# EAGLE design current_monitor_v1-2 (EAGLE 6.5.0)
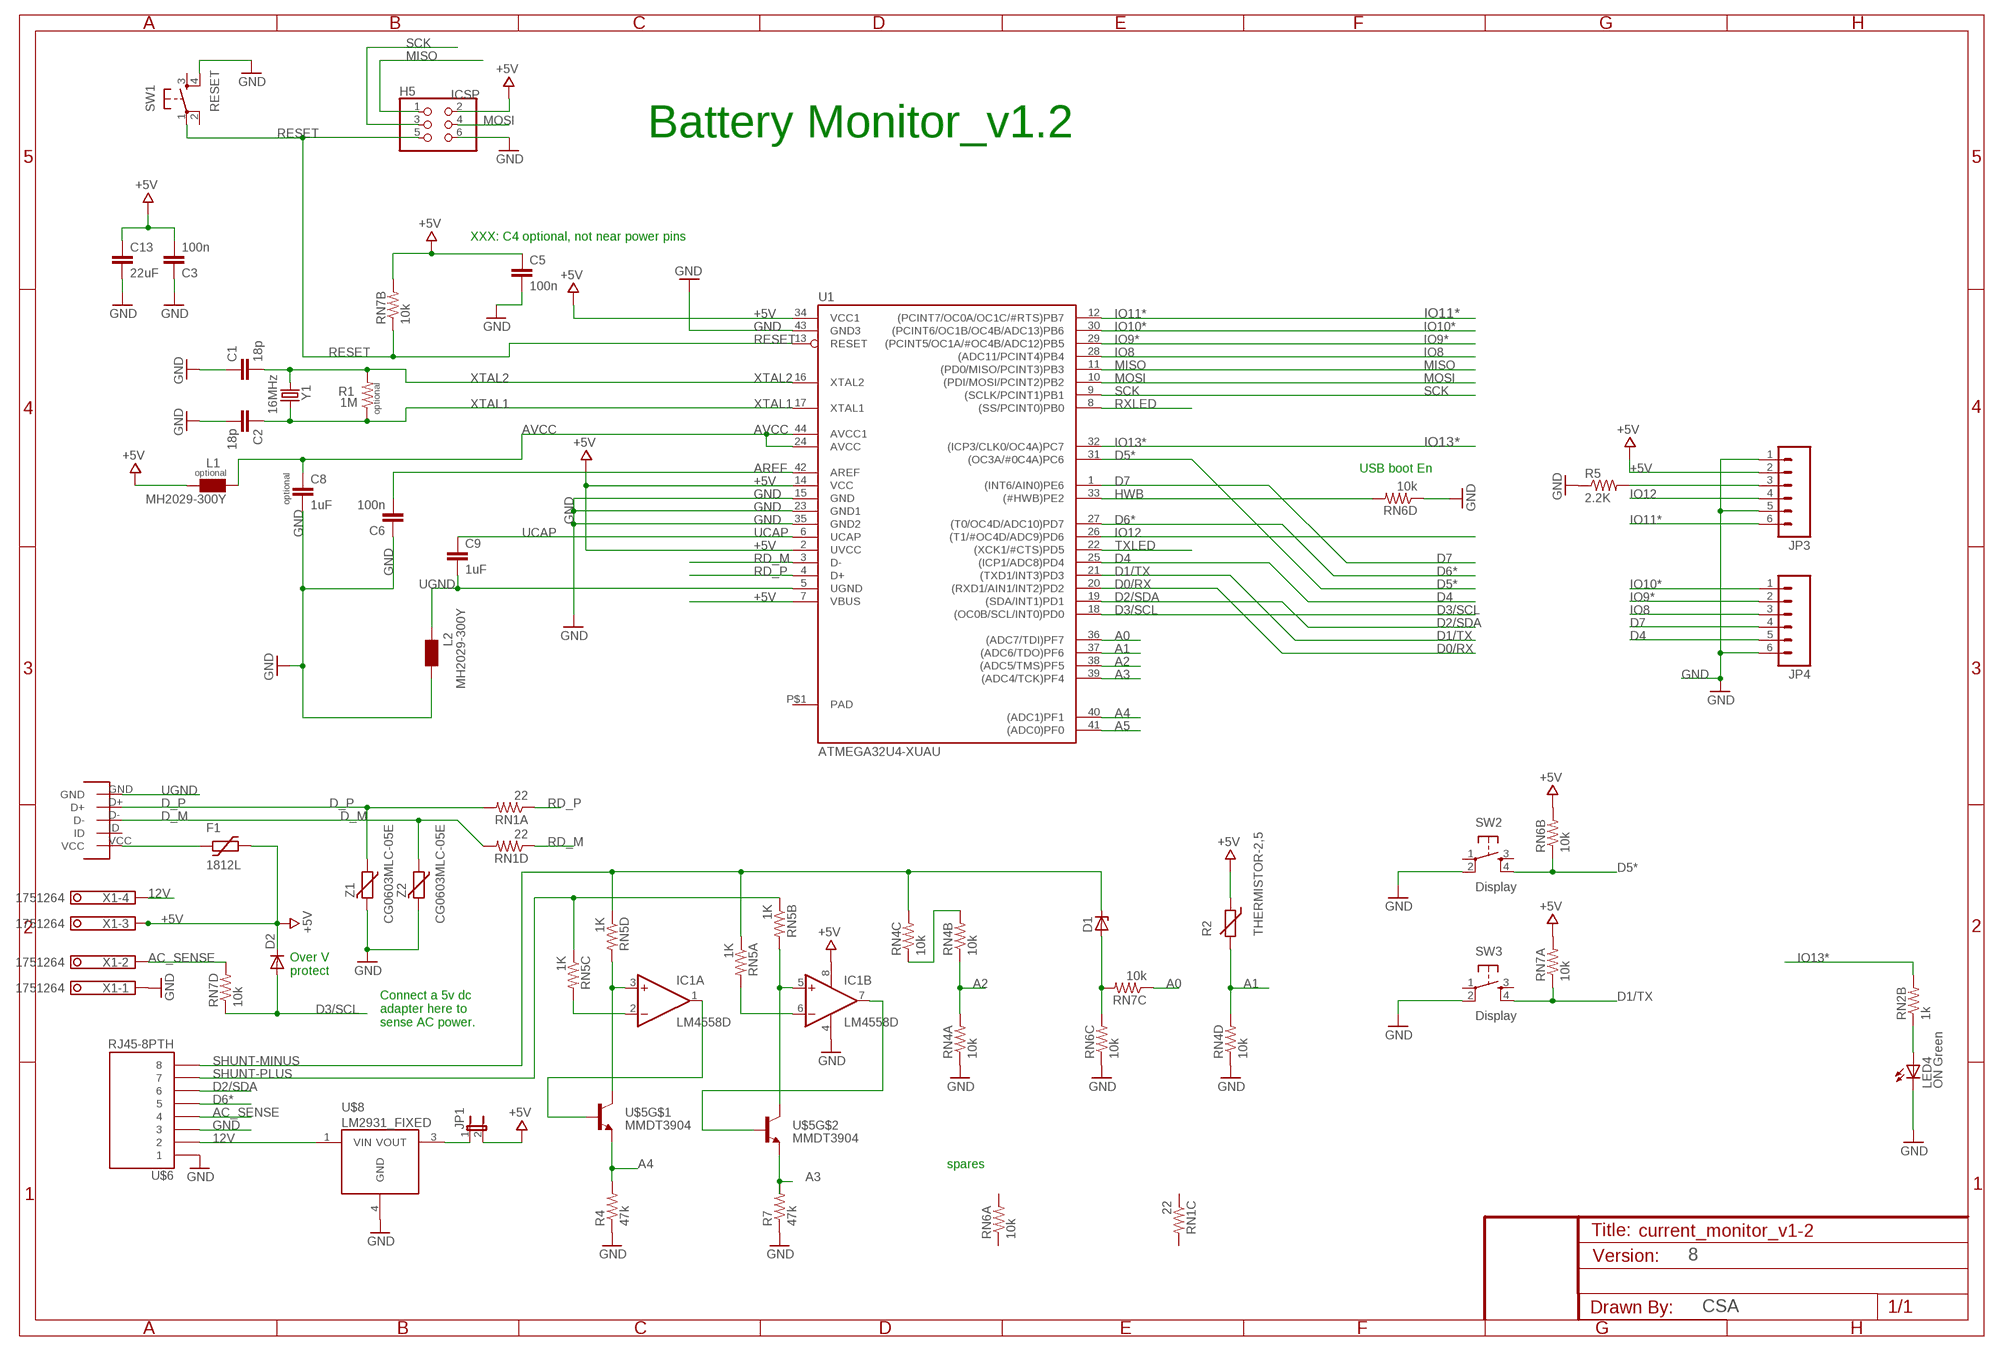
[diagram p0: schematic, sheet 1]

## Parts
C1  18p  CAP0805  [0805]
C2  18p  CAP0805  [0805]
C3  100n  CAP0805  [0805]
C5  100n  CAP0805  [0805]
C6  100n  CAP0805  [0805]
C8  1uF  CAP0805  [0805]
C9  1uF  CAP0805  [0805]
C13  22uF  CAP1206  [1206]
D1  ZENER-DIODEZD-5  [ZDIO-5]
D2  DIODESMA  [SMA-DIODE]
F1  1812L  [1812L]
H5  ICSP  PINHD-2X3  [2X03]
IC1  LM4558D  [SO08]
JP1  JUMPER-2-OLDPTH_LOCK  [1X02_LOCK]
JP3  M06FEMALE_LOCK  [1X06_FEMALE_LOCK.010]
JP4  M06FEMALE_LOCK  [1X06_FEMALE_LOCK.010]
L1  MH2029-300Y  WE-CBF_0805  [0805]
L2  MH2029-300Y  WE-CBF_0805  [0805]
LED4  ON Green  LED0805  [LED0805]
R1  1M  RESISTOR0805-RES  [0805]
R2  THERMISTOR-2,5  [RS-2,5]
R4  47k  RESISTOR0805-RES  [0805]
R5  2.2K  RESISTOR0805-RES  [0805]
R7  47k  RESISTOR0805-RES  [0805]
RN1  22  RESISTOR-ARRAYCRA06S  [CRA06S]
RN2  1k  RESISTOR-ARRAYCRA06S  [CRA06S]
RN4  10k  RESISTOR-ARRAYCRA06S  [CRA06S]
RN5  1K  RESISTOR-ARRAYCRA06S  [CRA06S]
RN6  10k  RESISTOR-ARRAYCRA06S  [CRA06S]
RN7  10k  RESISTOR-ARRAYCRA06S  [CRA06S]
SW1  RESET  TAC_SWITCHPTH  [TACTILE-PTH]
SW2  Display  TAC_SWITCHPTH  [TACTILE-PTH]
SW3  Display  TAC_SWITCHPTH  [TACTILE-PTH]
U1  ATMEGA32U4-XUAU  [TQFP44-PAD]
U$5  MMDT3904  [SOT363]
U$6  RJ45-8PTH  [RJ45-8]
U$8  LM2931_FIXED  [DPAK]
U$16  USB-MICRO-B-DIGIKEY  [USB-MICRO-B-DIGIKEY]
X1  1751264  [1751264]
Y1  16MHz  CRYSTALHC49US  [HC49US]
Z1  CG0603MLC-05E  VARISTORCN0603  [CT/CN0603]
Z2  CG0603MLC-05E  VARISTORCN0603  [CT/CN0603]

## Nets
12V: U$6.2 U$8.1(VIN) X1.4
+5V [power]: C3.2 C5.1 C13.1 D2.C F1.P$2 H5.2 IC1.8(P:V+) JP1.2 JP3.2 L1.1 R2.1 RN6.7 RN7.7 RN7.8 U1.2(UVCC) U1.7(VBUS) U1.14(VCC) U1.34(VCC1) X1.3
A0: D1.A RN6.6 RN7.3 RN7.6 U1.36((ADC7/TDI)PF7)
A1: R2.2 RN4.5 U1.37((ADC6/TDO)PF6)
A2: RN4.2 RN4.8 U1.38((ADC5/TMS)PF5)
A3: R7.2 U1.39((ADC4/TCK)PF4) U$5.1(E)
A4: R4.2 U1.40((ADC1)PF1) U$5.4(E)
A5: U1.41((ADC0)PF0)
AC_SENSE: RN7.5 U$6.4 X1.2
AREF [aref]: C6.2 U1.42(AREF)
AVCC: C8.1 L1.2 U1.24(AVCC) U1.44(AVCC1)
D0/RX: U1.20((RXD1/AIN1/INT2)PD2)
D1/TX: RN7.1 SW3.4 U1.21((TXD1/INT3)PD3)
D2/SDA: U1.19((SDA/INT1)PD1) U$6.6
D3/SCL: D2.A RN7.4 U1.18((OC0B/SCL/INT0)PD0)
D4: JP4.5 U1.25((ICP1/ADC8)PD4)
D5*: RN6.2 SW2.4 U1.31((OC3A/#0C4A)PC6)
D6*: U1.27((T0/OC4D/ADC10)PD7) U$6.5
D7: JP4.4 U1.1((INT6/AIN0)PE6)
D_M: RN1.5 U$16.D- Z2.1
D_P: RN1.8 U$16.D+ Z1.1
GND [gnd]: C1.1 C2.2 C3.1 C5.2 C6.1 C8.2 C13.2 H5.6 IC1.4(P:V-) JP3.1 JP3.5 JP4.6 L2.2 LED4.C R4.1 R5.1 R7.1 RN4.1 RN4.4 RN6.3 RN6.4 SW1.4 SW2.2 SW3.2 U1.15(GND) U1.23(GND1) U1.35(GND2) U1.43(GND3) U$6.1 U$6.3 U$8.4(GND) X1.1 Z1.2 Z2.2
HWB: RN6.5 U1.33((#HWB)PE2)
IO8: JP4.3 U1.28((ADC11/PCINT4)PB4)
IO9*: JP4.2 U1.29((PCINT5/OC1A/#OC4B/ADC12)PB5)
IO10*: JP4.1 U1.30((PCINT6/OC1B/OC4B/ADC13)PB6)
IO11*: JP3.6 U1.12((PCINT7/OC0A/OC1C/#RTS)PB7)
IO12: JP3.4 U1.26((T1/#OC4D/ADC9)PD6)
IO13*: RN2.7 U1.32((ICP3/CLK0/OC4A)PC7)
LED4_ANODE: LED4.A RN2.2
MISO: H5.1 U1.11((PD0/MISO/PCINT3)PB3)
MOSI: H5.4 U1.10((PDI/MOSI/PCINT2)PB2)
N$1: IC1.5(B:+IN) RN5.7 U$5.6(C)
N$2: IC1.2(A:-IN) RN5.6
N$3: IC1.6(B:-IN) RN5.8
N$4: IC1.1(A:OUT) U$5.5(B)
N$5: IC1.7(B:OUT) U$5.2(B)
N$6: IC1.3(A:+IN) RN5.5 U$5.3(C)
N$7: F1.P$1 U$16.VCC
N$8: JP1.1 U$8.3(VOUT)
N$10: RN4.3 RN4.7
N$12: JP3.3 R5.2
RD_M: RN1.4 U1.3(D-)
RD_P: RN1.1 U1.4(D+)
RESET: H5.5 RN7.2 SW1.1 U1.13(RESET)
RXLED: U1.8((SS/PCINT0)PB0)
SCK: H5.3 U1.9((SCLK/PCINT1)PB1)
SHUNT-MINUS: D1.C RN4.6 RN5.1 RN5.4 U$6.8
SHUNT-PLUS: RN5.2 RN5.3 U$6.7
TXLED: U1.22((XCK1/#CTS)PD5)
UCAP: C9.1 U1.6(UCAP)
UGND [gnd]: C9.2 L2.1 U1.5(UGND) U$16.GND
XTAL1: C2.1 R1.1 U1.17(XTAL1) Y1.2
XTAL2: C1.2 R1.2 U1.16(XTAL2) Y1.1
Unconnected: RN1.2 RN1.3 RN1.6 RN1.7 RN2.1 RN2.3 RN2.4 RN2.5 RN2.6 RN2.8 RN6.1 RN6.8 SW1.2 SW1.3 SW2.1 SW2.3 SW3.1 SW3.3 U$16.ID

## Notes on the sheet
- Battery Monitor_v1.2
- XXX: C4 optional, not near power pins
- optional
- USB boot En
- optional
- optional
- Over V
  protect
- Connect a 5v dc
  adapter here to 
  sense AC power.
- spares
- 8
- CSA

## Power pins joined to a net without a drawn wire
PAD: U1.P$1(PAD)

## Library data of the parts
C1-C3 C5 C6 C8 C9 C13 = SparkFun-Passives:CAP: Capacitor Standard 0603 ceramic capacitor, and 0.1" leaded capacitor.
D1 = diode:ZENER-DIODE: Z-Diode
D2 = SparkFun-DiscreteSemi:DIODE: Diode These are standard reverse protection diodes and small signal diodes. SMA package can handle up to about 1A. SOD-323 can handle about 200mA. What the SOD-323 package when ordering, there are some mfgs out there that are 5-pin packages.
F1 = ptc-littlefuse:1812L
H5 = SmartPrj:PINHD-2X3: PIN HEADER
IC1 = linear:*4558: OP AMP
JP1 = SparkFun-Passives:JUMPER-2-OLD: Jumper Basic 0.1" spaced jumper. Use with breakaway headers.
JP3 JP4 = SparkFun-Connectors:M06: Header 6 Standard 6-pin 0.1" header. Use with straight break away headers (SKU : PRT-00116), right angle break away headers (PRT-00553), swiss pins (PRT-00743), machine pins (PRT-00117), and female headers (PRT-00115). Molex polarized connector foot print use with SKU : PRT-08094 with associated crimp pins and housings. NOTES ON THE VARIANTS LOCK and LOCK_LONGPADS... This footprint was designed to help hold the alignment of a through-hole component (i.e. 6-pin header) while soldering it into place. You may notice that each hole has been shifted either up or down by 0.005 of an inch from it's more standard position (which is a perfectly straight line). This slight alteration caused the pins (the squares in the middle) to touch the edges of the holes. Because they are alternating, it causes a "brace" to hold the component in place. 0.005 has proven to be the perfect amount of "off-center" position when using our standard breakaway headers. Although looks a little odd when you look at the bare footprint, once you have a header in there, the alteration is very hard to notice. Also, if you push a header all the way into place, it is covered up entirely on the bottom side. This idea of altering the position of holes to aid alignment will be further integrated into the Sparkfun Library for other footprints. It can help hold any component with 3 or more connection pins.
L1 L2 = wuerth-elektronik:WE-CBF: SMD EMI Suppression Ferrite Beads - excellent anti-EMI properties - low DCR - impedances till 3000 ohms - rated current up to 6 A
LED4 = xorduino:LED
R1 R4 R5 R7 = SparkFun-Passives:RESISTOR: Resistor Basic schematic elements and footprints for 0603, 1206, and PTH resistors.
R2 = varistor:THERMISTOR: THERMISTOR
RN1 RN2 RN4-RN7 = xorduino:RESISTOR-ARRAY
SW1-SW3 = SparkFun-Electromechanical:TAC_SWITCH: Momentary Switch Button commonly used for reset or general input. Spark Fun Electronics SKU : COM-00097
U1 = SmartPrj:ATMEGA32U4-XU
U$5 = SparkFun-DiscreteSemi:MMDT3904: Dual NPN transistor
U$6 = SparkFun-Connectors:RJ45-8: RJ45 Jack Simple RJ45, 8-pin connection - connector for common Cat5, Cat5e, and Cat6 Ethernet cables. Footprint not yet proven in production. Connector sku is PRT-00643; Breakout PCB sku is BOB-00716.
U$8 = SparkFun-PowerIC:LM2931_FIXED: LDO regulator with reverse battery protection- very durable!
U$16 = gh_stuff:USB-MICRO-B-DIGIKEY
X1 = con-phoenix-350:1751264: MKDS 1/ 4-3,5 Printklemme Nennstrom: 10 A Bemessungsspannung: 160 V Raster: 3,5 mm Polzahl: 4 Montageart: Löten Anschlussart: Schraubanschluss Anschlussrichtung vom Leiter zur Platine: 0° Source: http://eshop.phoenixcontact.com .. 1751264.pdf; MPN: 1751264; OC_FARNELL: unknown; OC_NEWARK: 10R0934
Y1 = SparkFun-FreqCtrl:CRYSTAL: Various standard crystals. Proven footprints. Spark Fun Electronics SKU : COM-00534
Z1 Z2 = varistor:VARISTOR: VARISTOR

## Net classes
0 default: width 0.203 mm, drill 0.406 mm, clearance 0.205 mm
1 power: width 0.203 mm, drill 0.406 mm, clearance 0.205 mm to class 0, clearance 0.205 mm
2 gnd: width 0.203 mm, drill 0.406 mm, clearance 0.205 mm to class 0, clearance 0.205 mm to class 1, clearance 0.205 mm
3 usbvcc: width 0.203 mm, drill 0.406 mm, clearance 0.203 mm
4 aref: width 0.203 mm, drill 0.406 mm, clearance 0.205 mm to class 0, clearance 0.205 mm to class 1, clearance 0.205 mm to class 2, clearance 0.205 mm to class 3, clearance 0.205 mm

## Board
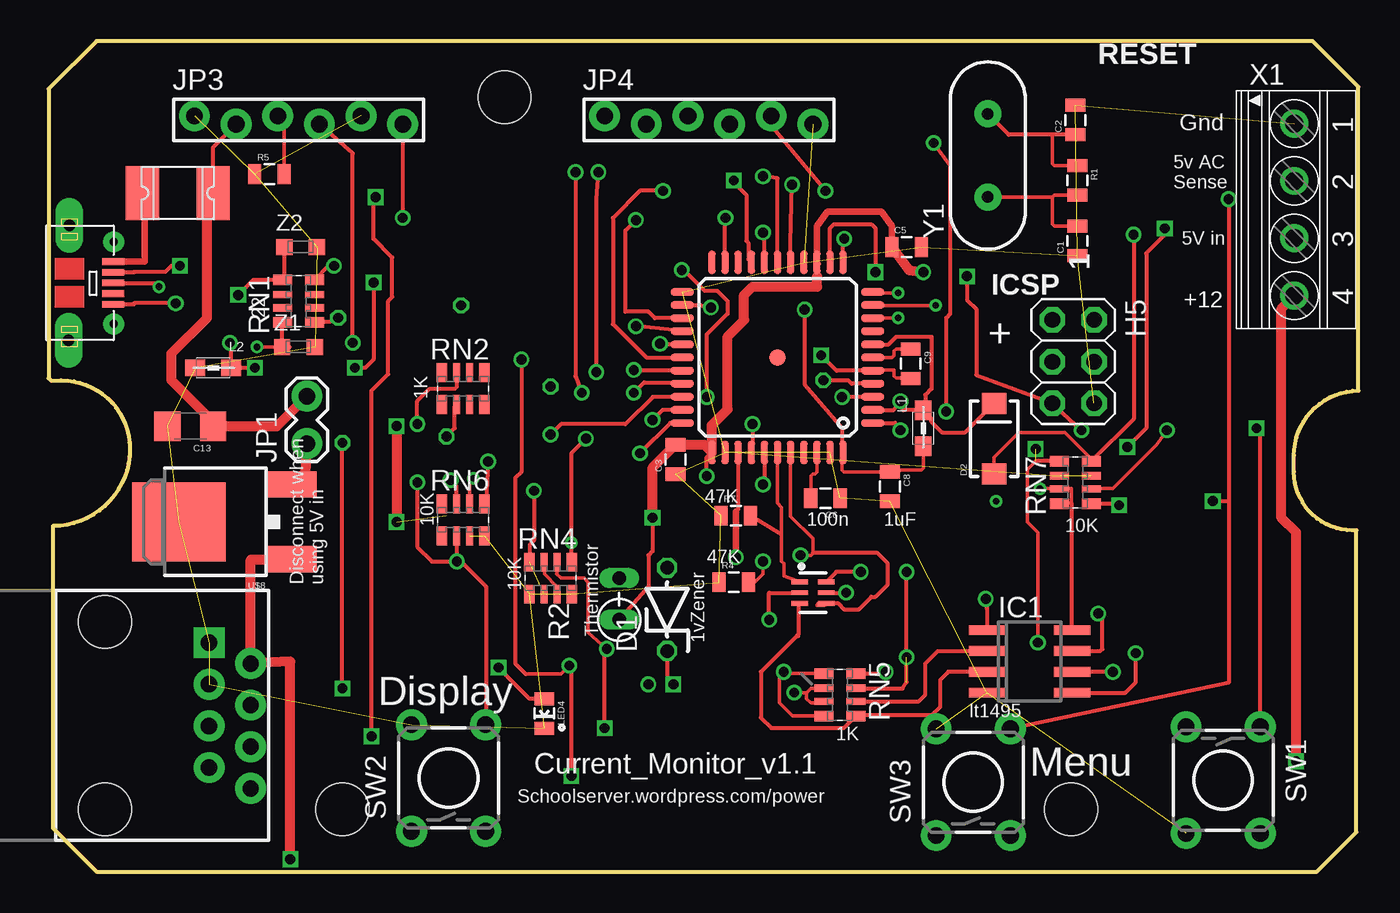
[diagram p1: board, top side]
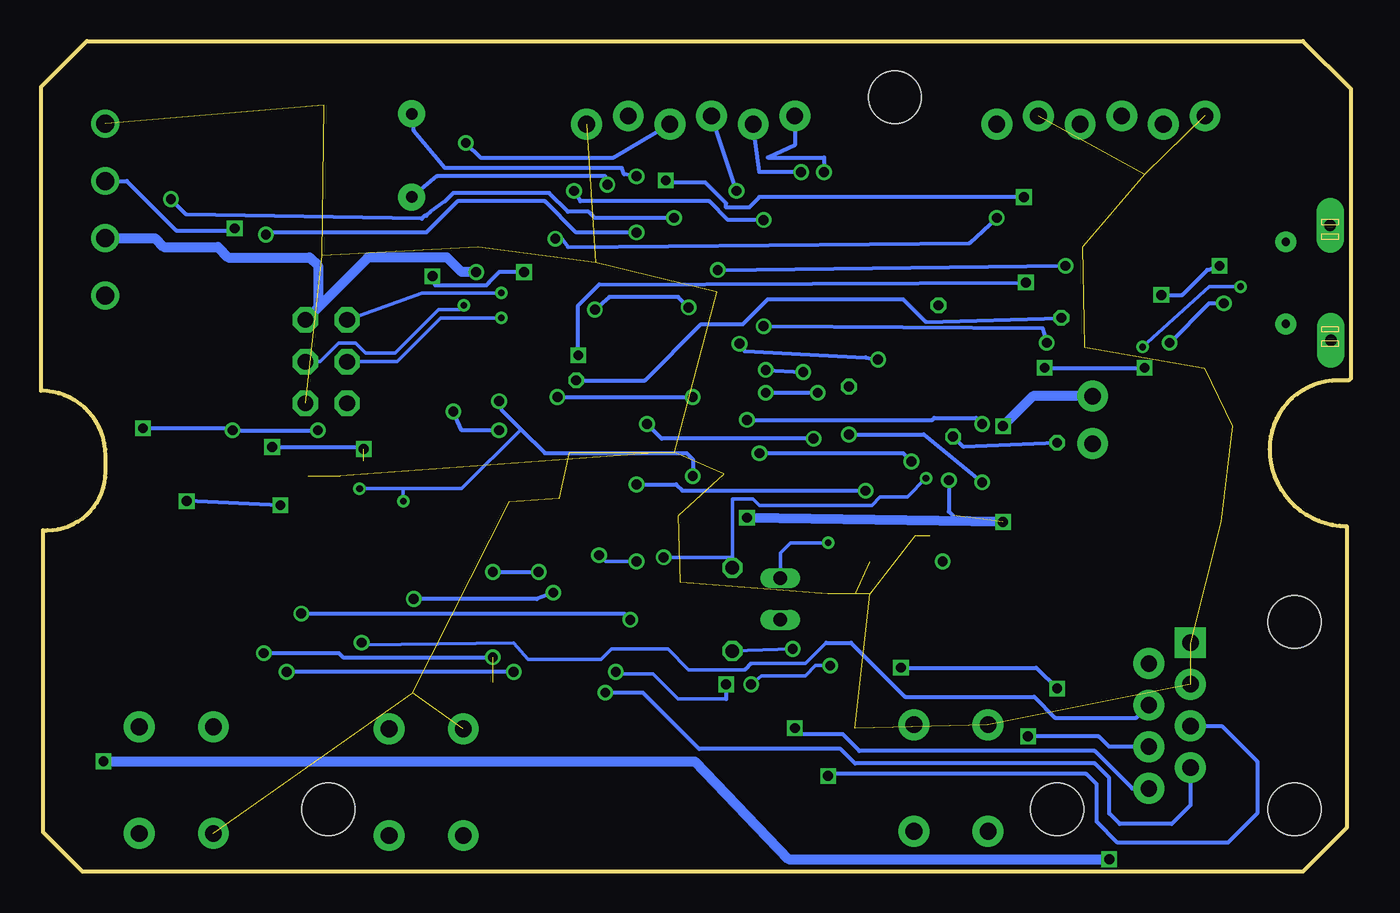
[diagram p2: board, bottom side, seen from below]

Size 79.88 x 50.67 mm. Coordinates in mm from the lower left corner, seen from the top.
Copper layers (1*16): Top 0.0356mm / dielectric 1.5011mm / Bottom 0.0356mm
Design rules "LaenPCBOrder": minimum track width 6mil, minimum drill 13mil, track to track 6mil, track to pad 6mil, pad to pad 6mil, via to via 6mil, smd to smd 6mil, copper to edge 15mil, drill to drill 6mil, minimum pad ring 7mil, minimum via ring 7mil, stop-mask expansion 4mil, vias tented up to drill 0mil, thermal gap 10mil
Holes 3.2 mm at 62.36,3.81 27.81,47.24 17.91,3.81

### Footprints (pad centres in the part's own frame; a part is rotated, then mirrored left to right if it is on the bottom)
0805 = smd 0.8 x 1.2: 1 -0.9,0; 2 0.9,0
1206 = smd 1.6 x 1.8: 1 -1.4,0; 2 1.4,0
ZDIO-5 = drill 0.813 octagon: A 2.54,0; C -2.54,0
SMA-DIODE = smd 1.27 x 1.47: A -2.15,0; C 2.15,0
1812L = smd 2.03 x 3.3: P$1 -2.16,0; P$2 2.16,0
2X03 = drill 0.95 pad 1.55 octagon: 1 -2.54,-1.27; 2 -2.54,1.27; 3 0,-1.27; 4 0,1.27; 5 2.54,-1.27; 6 2.54,1.27
SO08 = smd 0.6 x 2.2: 1 -1.905,-2.6; 2 -0.635,-2.6; 3 0.635,-2.6; 4 1.905,-2.6; 5 1.905,2.6; 6 0.635,2.6; 7 -0.635,2.6; 8 -1.905,2.6
1X02_LOCK = drill 1.016 pad 1.88: 1 -0.178,0; 2 2.718,0
1X06_FEMALE_LOCK.010 = drill 1.016 pad 1.88: 1 0,0.254; 2 2.54,-0.254; 3 5.08,0.254; 4 7.62,-0.254; 5 10.16,0.254; 6 12.7,-0.254
0805' = smd 1.2 x 1: 1 -1.1,0; 2 1.1,0
LED0805 = smd 0.8 x 1.2: A -0.9,0; C 0.9,0
RS-2,5 = drill 0.813 long: 1 -1.27,0; 2 1.27,0
CRA06S = smd 0.63 x 1.15: 1 -1.295,-0.975; 4 1.295,-0.975; 5 1.295,0.975; 8 -1.295,0.975 | smd 0.44 x 1.15: 2 -0.4,-0.975; 3 0.4,-0.975; 6 0.4,0.975; 7 -0.4,0.975
TACTILE-PTH = drill 1.016 pad 1.88: 1 -3.251,2.261; 2 3.251,2.261; 3 -3.251,-2.261; 4 3.251,-2.261
TQFP44-PAD = smd 1.4 x 0.45: 1 -5.8,4; 2 -5.8,3.2; 3 -5.8,2.4; 4 -5.8,1.6; 5 -5.8,0.8; 6 -5.8,0; 7 -5.8,-0.8; 8 -5.8,-1.6; 9 -5.8,-2.4; 10 -5.8,-3.2; 11 -5.8,-4; 23 5.8,-4; 24 5.8,-3.2; 25 5.8,-2.4; 26 5.8,-1.6; 27 5.8,-0.8; 28 5.8,0; 29 5.8,0.8; 30 5.8,1.6; 31 5.8,2.4; 32 5.8,3.2; 33 5.8,4 | smd 0.45 x 1.4: 12 -4,-5.8; 13 -3.2,-5.8; 14 -2.4,-5.8; 15 -1.6,-5.8; 16 -0.8,-5.8; 17 0,-5.8; 18 0.8,-5.8; 19 1.6,-5.8; 20 2.4,-5.8; 21 3.2,-5.8; 22 4,-5.8; 34 4,5.8; 35 3.2,5.8; 36 2.4,5.8; 37 1.6,5.8; 38 0.8,5.8; 39 0,5.8; 40 -0.8,5.8; 41 -1.6,5.8; 42 -2.4,5.8; 43 -3.2,5.8; 44 -4,5.8 | smd 1 x 1: P$1 0,0
SOT363 = smd 0.3 x 0.99: 1 -0.65,-0.8; 2 0,-0.8; 3 0.65,-0.8; 4 0.65,0.81; 5 0,0.81; 6 -0.65,0.81
RJ45-8 = drill 1 pad 1.88 square: 1 -4.445,6.35 | drill 1 pad 1.88: 2 -3.175,8.89; 3 -1.905,6.35; 4 -0.635,8.89; 5 0.635,6.35; 6 1.905,8.89; 7 3.175,6.35; 8 4.445,8.89 | hole 3.2: -5.715,0; 5.715,0
DPAK = smd 1.6 x 3: 1 -2.28,-5.31; 3 2.28,-5.31 | smd 4.826 x 5.715: 4 0,1.588
USB-MICRO-B-DIGIKEY = smd 0.4 x 1.35: D+ 0,-0.03; D- -0.65,-0.03; GND 1.3,-0.03; ID 0.65,-0.03; VCC -1.3,-0.03 | drill 0.7 pad 1.676 long: P$1 -3.5,-2.7; P$2 3.5,-2.75 | drill 0.5 pad 1.27: P$3 -2.5,0; P$4 2.5,0
1751264 = drill 1.1 pad 1.7: 1 -5.25,-0.1; 2 -1.75,-0.1; 3 1.75,-0.1; 4 5.25,-0.1
HC49US = drill 0.7 pad 1.651: 1 -2.54,0; 2 2.54,0
CT/CN0603 = smd 1 x 1: 1 -1,0; 2 1,0

### Placement (x,y rotation side)
C1  62.74,38.48 90 top
C2  62.61,45.85 90 top
C3  38.23,25.15 90 top
C5  52.32,38.1 0 top
C6  47.37,22.78 180 top
C8  51.31,23.5 270 top
C9  52.58,30.99 270 top
C13  8.64,27.18 180 top
D1  37.72,16 90 top
D2  57.66,26.42 90 top
F1  7.87,41.4 0 top
H5  62.48,31.11 270 top
IC1  59.82,12.83 270 top
JP1  15.75,26.29 90 top
JP3  8.89,45.85 0 top
JP4  33.91,45.85 0 top
L1  MH2029-300Y  [0805']  53.34,27.05 270 top
L2  MH2029-300Y  [0805']  10.03,30.73 180 top
LED4  30.23,9.65 270 top
R1  62.74,42.16 270 top
R2  34.8,16.64 90 top
R4  41.78,17.65 0 top
R5  13.46,42.55 0 top
R7  41.91,21.72 0 top
RN1  15.24,34.8 90 top
RN2  25.27,29.46 0 top
RN4  30.61,17.91 0 top
RN5  48.26,10.79 270 top
RN6  25.27,21.46 0 top
RN7  62.61,23.75 90 top
SW1  71.63,5.59 270 top
SW2  24.38,5.71 90 top
SW3  56.39,5.46 90 top
U1  44.45,31.37 180 top
U$5  46.61,17.02 270 top
U$6  3.43,9.53 270 top
U$8  9.53,21.34 90 top
U$16  3.96,35.91 270 top
X1  76.07,40.39 270 top
Y1  57.28,43.69 90 top
Z1  15.24,32 0 top
Z2  15.37,38.1 0 top

### Tracks (layer width: path | path; a pad name or v marks a point on that pad's centre or on a via)
12V  (via drill 0.6)
  Top 0.61: U$8.1 12.32,19.03 U$6.2 14.73,12.83 v14.73,0.76 | v76.07,6.73 76.07,20.7 75.18,21.59 75.18,34.35 X1.4
  Bottom 0.61: v76.07,6.73 40.01,6.73 34.29,0.76 v14.73,0.76
+5V  (via drill 0.41, 0.6)  (1 unrouted)
  Top 0.203: 46.74,36.96 46.86,37.08 U1.14 | RN7.8 61.72,22.48 62.36,22.48 62.36,23.37 61.72,23.37 RN7.7 61.59,23.37 v60.45,23.37
  Top 0.254: 46.86,37.18 U1.14 46.91,37.17 46.99,37.08 | 51.44,38.09 C5.1 | U1.2 51.54,28.17 v51.94,28.7 52.11,28.15 L1.1 | v40.13,24.13 40.13,25.25 U1.34 | U1.7 51.22,32.17 51.69,32.64 53.85,32.64 53.85,29.46 53.47,29.08 53.47,28.28 L1.1 | v36.83,21.59 36.83,19.56 36.58,19.3 36.58,17.4 R2.1 | RN6.7 24.87,23.51 v24.51,23.88 | JP3.2 10.03,44.2 F1.P$2 9.65,41.02 | D2.C 55.89,26.8 54.48,26.8 53.85,27.43 53.85,27.64 L1.1 | 62.36,22.48 62.36,14.79 IC1.8
  Top 0.305: 46.86,36.32 46.86,37.16 U1.14
  Top 0.406: C5.1 51.42,39.38 50.8,40.26 47.5,40.26 46.86,39.37 46.86,37.18
  Top 0.61: v36.83,21.59 36.83,24.65 C3.2 39.97,26.05 U1.34 40.45,27.24 41.4,28.19 41.4,32.64 42.42,33.66 42.42,35.18 42.93,35.69 46.86,35.69 46.86,36.32 | 51.44,38.09 52.45,36.7 v53.34,36.58 | 9.65,41.02 9.65,33.78 7.49,31.62 7.49,29.97 9.65,27.81 C13.1 13.92,27.18 JP1.2 | v21.21,27.18 v21.21,21.34
  Bottom 0.203: 57.79,23.37 54.23,23.37 50.61,26.99 | 57.79,23.37 v60.45,23.37 | 57.79,23.37 v57.79,22.61
  Bottom 0.254: v51.94,28.7 51.82,28.19 50.61,26.99 49.15,25.53 40.51,25.53 40.13,25.15 v40.13,24.13 | v24.51,23.88 24.51,21.97 24.26,21.72
  Bottom 0.61: 36.7,21.72 v36.83,21.59 v21.21,21.34 | v53.34,36.58 54.23,36.58 55.12,37.47 59.94,37.47 H5.2 62.99,34.42 62.99,36.96 63.5,37.47 68.45,37.47 69.09,38.1 72.39,38.1 72.93,38.64 X1.3 | 21.16,27.23 v21.21,27.18 19.38,29.01 JP1.2
A0  (via drill 0.41, 0.6)  (2 unrouted)
  Top 0.203: v25.91,24 25.65,23.75 25.65,22.48 RN6.6
  Top 0.254: U1.36 42.05,22.11 41.91,21.97
  Top 0.406: 41.91,21.97 v41.91,19.18
  Bottom 0.203: v25.91,24 27.05,22.86 28.7,22.86 29.21,22.35 36.07,22.35 36.45,22.73 37.72,22.73 37.72,19.18 | D1.A 37.72,19.18 | 37.72,19.18 v41.91,19.18
A1  (via drill 0.41, 0.6)
  Top 0.203: v31.88,20.07 31.9,20.07
  Top 0.254: RN4.5 31.9,20.07 31.9,25.55 v32.77,26.42 | v42.93,27.3 42.93,25.64 U1.37
  Bottom 0.203: R2.2 34.8,19.43 34.16,20.07 v31.88,20.07
  Bottom 0.254: v32.77,26.42 42.04,26.42 v42.93,27.3
A2  (via drill 0.6)  (2 unrouted)
  Top 0.254: U1.38 43.65,23.71 v43.56,23.62 | v29.59,23.24 29.59,20.19 29.34,19.94 29.34,18.91
  Bottom 0.254: v43.56,23.62 41.15,23.62 40.77,23.24 v29.59,23.24
A3
  Top 0.203: 44.7,20.57 44.7,18.92 44.83,18.8 44.83,18.03 U$5.1 | U1.39 44.45,22.48 44.7,22.23 44.7,20.57 | 44.7,20.57 R7.2
A4  (via drill 0.6)
  Top 0.203: U1.40 45.25,21.68 46.61,20.32 46.61,19.43 46.48,19.3 v45.85,19.3 | 46.86,16.26 47.31,16.26 | R4.2 43.05,17.65 43.56,18.16 v43.56,18.92
  Top 0.254: U$5.4 47.31,16.26 | 46.86,16.26 46.99,16.38 48.13,16.38 48.51,16 49.4,16 50.16,16.76 50.42,16.76 51.18,17.53 51.18,18.8 50.55,19.43 46.61,19.43
  Bottom 0.203: v43.56,18.92 45.47,18.92 v45.85,19.3
AC_SENSE  (via drill 0.6)  (1 unrouted)
  Top 0.203: v60.33,13.97 60.33,20.7 59.69,21.34 59.69,24.54 60.2,25.04
  Top 0.254: RN7.5 60.2,25.04 | v68.07,39.24 68.07,38.86 66.93,37.72 66.93,27.05 v65.79,25.91
  Bottom 0.203: 32,13.97 33.27,12.7 36.58,12.7 | 36.96,12.32 40.39,12.32 41.66,13.59 45.09,13.59 45.72,12.95 50.16,12.95 51.05,13.97 60.2,13.84 v60.33,13.97
  Bottom 0.254: 36.58,12.7 36.96,12.32 | 32,13.97 30.48,13.97 27.18,10.67 19.3,10.67 18.03,9.4 13.08,9.4 U$6.4 | X1.2 74.65,42.14 71.63,39.12 68.2,39.12 v68.07,39.24 | v65.79,25.91 60.33,25.91 v60.2,25.78
AREF
  Top 0.203: C6.2 46.48,22.86 46.48,24.13 46.61,24.26 46.74,24.26 46.86,24.38 46.86,25.53 U1.42
AVCC  (via drill 0.6)
  Top 0.203: 50.16,24.38 48.51,24.38 48.39,24.51 48.39,25.53 U1.44 | L1.2 53.34,24.64 53.21,24.51 51.94,24.51 51.82,24.38 50.16,24.38 | 50.16,24.38 C8.1
  Top 0.254: U1.24 39.73,34.57 v40.39,34.42 | v46.1,34.29 46.1,29.72 48.39,27.05 48.39,25.63 U1.44
  Bottom 0.254: v40.39,34.42 41.02,35.05 45.21,35.05 v46.1,34.29
D1/TX  (via drill 0.6)
  Top 0.254: U1.21 41.25,39.85 v41.27,39.88 | v71.96,41.02 71.96,22.61 | 71.96,22.61 71.96,11.53 SW3.4 | RN7.1 65.28,22.45 v65.28,22.35 | v70.99,22.61 71.96,22.61
  Bottom 0.254: v41.27,39.88 46.1,39.88 46.48,40.26 47.75,40.26 48.9,41.4 54.74,41.4 55.24,40.89 56.13,40.26 56.39,40.01 56.49,40.01 56.67,39.83 71.02,40.08 v71.96,41.02 | v65.28,22.35 v70.99,22.61
D2/SDA  (via drill 0.6)
  Top 0.254: v19.68,8.26 19.68,29.34 20.7,30.35 20.7,34.8 20.96,35.05 20.96,37.47 19.81,38.61 19.81,41.02 v19.94,41.15 | v41.78,42.16 41.78,42.04 42.55,41.27 42.55,38.48 42.67,38.35 42.67,37.35 U1.19
  Bottom 0.254: U$6.6 14.73,7.62 15.37,8.26 v19.68,8.26 | v19.94,41.15 36.07,41.15 36.7,40.51 38.1,40.51 38.1,40.77 39.37,42.04 41.66,42.04 v41.78,42.16
D3/SCL  (via drill 0.6)
  Top 0.203: RN7.4 63.59,25.19 61.98,26.8 59.18,26.8 57.66,25.27 D2.A
  Top 0.254: U1.18 43.65,38.95 v43.56,38.99 | v66.17,38.86 66.17,27.62 RN7.4
  Bottom 0.254: v43.56,38.99 47.24,38.99 49.15,40.89 54.48,40.89 56.39,38.99 66.04,38.99 v66.17,38.86
D4  (via drill 0.6)
  Top 0.254: U1.25 36.97,33.77 36.58,34.16 35.18,34.16 35.18,39.12 v35.81,39.75 | v47.37,41.53 44.2,45.34 JP4.5
  Bottom 0.254: v35.81,39.75 37.97,39.75 39.12,40.89 46.99,40.89 v47.37,41.53
D5*  (via drill 0.6)
  Top 0.254: v24.89,18.92 24.89,20.47 RN6.2 | U1.31 36.84,28.97 35.18,27.3 31.24,27.3 v30.61,26.67 | v22.48,23.75 22.48,19.81 23.37,18.92 v24.89,18.92 | v24.89,18.92 25.15,18.92 26.67,17.4 26.67,8.99 SW2.4
  Bottom 0.254: v30.61,26.67 26.04,26.67 v22.48,23.75
D6*  (via drill 0.6)
  Top 0.203: 29.08,12.06 31.24,12.06 v31.75,12.57
  Top 0.254: U1.27 37.5,32.17 v37.29,32.21 | v28.83,31.24 28.83,24.38 28.45,24 28.45,12.7 29.08,12.06 | v31.88,5.84 31.88,12.45 v31.75,12.57
  Bottom 0.203: v31.75,12.57 32.64,12.57 33.27,11.94 35.94,11.94 v36.58,11.43
  Bottom 0.254: v37.29,32.21 37.34,32.13 36.96,31.75 29.59,31.37 v28.83,31.24 | U$6.5 7.87,8.89 5.71,6.73 5.71,3.56 7.49,1.78 14.22,1.78 15.49,3.05 15.49,5.33 16.13,5.97 31.75,5.97 v31.88,5.84
D7  (via drill 0.6)
  Top 0.254: U1.1 51.62,27.37 v51.94,26.92 | v54.74,28.07 54.74,33.78 54.99,34.04 54.99,43.05 v53.98,44.45
  Bottom 0.254: v51.94,26.92 54.23,26.92 v54.74,28.07 | v53.98,44.45 53.09,43.56 44.96,43.56 JP4.4
D_M  (via drill 0.6)
  Top 0.254: v11.56,35.18 12.47,36.09 RN1.5 14.37,36.2 Z2.1 | v8,36.96 7.49,36.96 7.11,36.58 5.19,36.58 5.19,36.56 U$16.D-
  Bottom 0.254: v11.56,35.18 10.29,35.18 8.76,36.7 v8,36.96
D_P  (via drill 0.41)
  Top 0.203: 14.73,32 Z1.1 v12.7,32
  Top 0.254: Z1.1 14.24,33.48 RN1.8 | U$16.D+ 6.73,35.91 v6.73,35.69
  Bottom 0.203: v6.73,35.69 8.64,35.69 v12.7,32
GND  (33 unrouted)
  pour Bottom (rank 5): 2.92,0 77.34,0 79.76,2.41 79.76,48.13 77.09,50.04 3.05,50.04 0.51,47.5 0.51,2.92
  pour Top (rank 6): 0.38,0 79.76,0 79.76,50.16 0.38,50.16
HWB  (via drill 0.6)
  Top 0.254: U1.33 37.91,27.37 v36.07,25.53 | v26.8,25.02 26.67,22.54 RN6.5
  Bottom 0.254: v36.07,25.53 27.3,25.53 v26.8,25.02
IO8  (via drill 0.6)
  Top 0.254: v37.47,41.53 36.07,41.53 34.42,39.88 34.42,33.4 36.45,31.37 U1.28
  Bottom 0.254: v37.47,41.53 JP4.3
IO9*  (via drill 0.6)
  Top 0.254: U1.29 35.73,30.57 v35.69,30.61 | v33.4,30.48 33.4,41.02 v33.53,42.67
  Bottom 0.254: v35.69,30.61 v33.4,30.48 | v33.53,42.67 36.07,42.67 JP4.2
IO10*  (via drill 0.6)
  Top 0.203: 38.73,29.72 U1.30
  Top 0.254: v32.13,42.67 32.13,30.23 v32.51,29.21 | v35.69,29.21 36.32,29.84 38.57,29.84 U1.30 | 38.73,29.72 38.61,29.84
  Bottom 0.254: JP4.1 33.91,44.32 35.56,43.56 32.13,43.56 v32.13,42.67 | v32.51,29.21 v35.69,29.21
IO11*  (via drill 0.6)
  Top 0.254: U1.12 48.45,38.54 v48.51,38.61 | JP3.6 v21.59,39.88
  Bottom 0.254: v48.51,38.61 48.13,38.61 47.75,38.1 23.24,38.35 v21.59,39.88
IO12  (via drill 0.6)
  Top 0.254: U1.26 36.4,33.22 v35.81,33.27 | v18.54,32.26 18.54,43.81 JP3.4
  Bottom 0.254: v35.81,33.27 18.8,33.15 v18.54,32.26
IO13*  (via drill 0.6)
  Top 0.254: U1.32 37.44,28.17 v36.83,27.56 | v22.48,27.3 22.48,28.7 23.24,29.46 24.77,29.46 24.89,29.59 24.89,30.42 RN2.7
  Bottom 0.254: v36.83,27.56 25.53,27.56 25.4,27.69 22.86,27.69 v22.48,27.3
LED4_ANODE  (via drill 0.6)
  Top 0.254: 18.03,26.04 v17.91,26.16 v17.91,11.18 | v24.26,26.54 24.77,27.05 24.77,28.38 RN2.2 | LED4.A 29.33,10.55 v27.43,12.45
  Bottom 0.254: v17.91,26.16 23.62,25.91 v24.26,26.54 | v27.43,12.45 19.18,12.45 v17.91,11.18
MISO  (via drill 0.41)
  Top 0.203: v51.82,35.31 50.29,35.31 U1.11
  Bottom 0.203: v51.82,35.31 56.64,35.31 H5.1
MOSI  (via drill 0.41)
  Top 0.203: v54.1,34.54 50.29,34.54 U1.10
  Bottom 0.203: H5.4 62.87,31.11 61.72,32.26 60.71,32.26 60.07,31.62 58.29,31.62 55.63,34.29 54.36,34.29 v54.1,34.54
N$1  (via drill 0.6)  (1 unrouted)
  Top 0.203: 49.25,11.18 RN5.7
  Top 0.254: 49.25,11.18 52.07,11.18 52.32,11.56 v52.32,18.29 | v49.53,18.29 48.04,18.29 U$5.6 | IC1.5 65.66,10.92 66.29,11.56 v66.29,13.34
  Bottom 0.254: v52.32,18.29 v49.53,18.29 | v66.29,13.34 61.72,13.34 61.47,13.08 v52.32,13.08
N$2
  Top 0.254: RN5.6 53.07,10.39 53.47,10.79 53.47,12.7 54.23,13.46 IC1.2
N$3  (via drill 0.6)
  Top 0.254: RN5.8 50.95,12.09 v51.05,12.19 | v64.9,12.19 IC1.6
  Bottom 0.254: v51.05,12.19 v64.9,12.19
N$4  (via drill 0.6)
  Top 0.254: U$5.5 v48.64,17.02 | v57.15,16.64 57.22,16.06 IC1.1
  Bottom 0.254: v48.64,17.02 49.66,16.64 v57.15,16.64
N$5  (via drill 0.6)
  Top 0.254: IC1.7 64.13,13.46 64.26,13.59 64.26,15.49 v64.01,15.75 | v43.94,15.37 43.94,17.02 U$5.2
  Bottom 0.254: v64.01,15.75 44.32,15.75 v43.94,15.37
N$6
  Top 0.203: 45.72,14.35 45.66,14.41
  Top 0.254: U$5.3 45.72,16.37 45.72,14.48 45.66,14.41 43.43,12.19 43.43,9.4 44.07,8.76 48.5,8.76 RN5.5 49.26,9.53 53.85,9.53 54.36,10.03 54.36,11.68 54.86,12.19 IC1.3
N$7
  Top 0.406: U$16.VCC 5.84,37.21 5.84,40.39 5.71,40.39 F1.P$1
N$8
  Top 0.61: U$8.3 15.67,24.25 JP1.1
N$9  (via drill 0.6)
  other vias: 30.61,29.59
N$10
  Top 0.203: RN4.7 30.23,18.8 30.23,18.16 30.99,17.4 30.99,17.02 RN4.3
N$12
  Top 0.203: JP3.3 14.35,45.72 R5.2
N$24  (via drill 0.6)
  other vias: 25.15,34.54
RD_M  (via drill 0.6)
  Top 0.254: U1.3 v48.4,28.97 v48.39,28.96 | v17.4,36.96 17.08,36.96 RN1.4 | v38.61,36.7 38.73,36.7 40.01,35.43 40.77,35.43 41.4,34.8 41.4,34.04 40.13,32.77 v40.13,28.96
  Bottom 0.254: v48.39,28.96 v40.13,28.96 | v38.61,36.7 v17.4,36.96
RD_P  (via drill 0.6)
  Top 0.254: U1.4 48.97,29.77 48.77,29.97 v47.24,29.97 | v17.65,33.78 17.4,33.78 17.14,33.53 16.24,33.53 RN1.1
  Bottom 0.254: v47.24,29.97 43.05,29.97 39.62,33.4 37.08,33.4 35.56,34.92 27.3,34.92 25.91,33.53 v17.65,33.78
RESET  (via drill 0.6)
  Top 0.203: v68.2,26.92 67.56,26.04 64.9,23.37 63.63,23.37 RN7.2
  Top 0.254: U1.13 47.65,39.27 47.88,39.5 50.16,39.5 50.42,39.24 v50.42,36.58 | v56.01,36.32 56.01,34.87 56.57,34.31 56.57,30.3 H5.5 61.47,28.32 v62.99,26.92 | SW1.1 73.89,26.82 v73.66,27.05
  Bottom 0.254: v50.42,36.58 51.94,36.58 52.58,35.94 52.58,35.92 52.73,35.76 55.83,35.76 v56.01,36.32 | v62.99,26.92 v68.2,26.92 68.33,27.05 v73.66,27.05
SCK  (via drill 0.41)
  Top 0.203: v51.82,33.78 50.29,33.78 U1.9
  Bottom 0.203: v51.82,33.78 55.5,33.78 58.17,31.11 H5.3
SHUNT-MINUS  (via drill 0.6)
  Top 0.203: RN5.1 44.93,12.09 v44.83,12.19 44.58,11.94 44.58,10.29 45.36,9.5 RN5.4 | RN4.6 31.01,18.18 30.99,18.16 31.24,17.91 32.64,17.91 32.89,17.65 32.89,14.61 v34.04,13.59
  Top 0.254: D1.C 37.72,11.68 v38.1,11.43 | v33.91,8.76 33.91,13.46 v34.04,13.59
  Bottom 0.203: 38.1,10.54 41.02,10.54 42.55,12.06 44.7,12.06 v44.83,12.19 | v34.04,13.59 D1.C
  Bottom 0.254: v38.1,11.43 38.1,10.54 | U$6.8 13.34,5.08 15.62,7.37 29.97,7.37 30.99,8.38 33.53,8.38 v33.91,8.76
SHUNT-PLUS  (via drill 0.6)
  Top 0.203: 46.5,11.2 46.48,11.18 | 46.48,11.18 46.23,10.92 | 46.23,10.92 46.23,10.54 46.48,10.29 47.24,10.29 RN5.3 | v45.47,10.92 46.23,10.92 | 46.48,11.18 47.24,11.18 RN5.2
  Bottom 0.254: U$6.7 9.78,4.06 10.92,2.92 14.1,2.92 14.73,3.56 14.73,5.71 15.62,6.6 30.23,6.6 31.12,7.49 39.75,7.49 43.18,10.92 v45.47,10.92
UCAP
  Top 0.203: U1.6 51.44,31.37 51.56,31.5 51.56,31.75 51.69,31.88 53.09,31.88 C9.1
UGND  (via drill 0.6)
  Top 0.203: C9.2 53.09,30.1 51.69,30.1 51.56,30.23 51.56,30.61 50.29,30.61 U1.5
  Top 0.254: v11.05,32.26 11.13,32.17 L2.1 v12.57,30.73 | v7.75,34.67 5.21,34.67 5.21,34.61 U$16.GND | U1.5 48.04,30.57 v47.12,31.5 | v19.81,35.94 19.81,31.24 19.3,30.73 v18.67,30.73
  Bottom 0.254: v11.05,32.26 8.64,34.67 v7.75,34.67 | v47.12,31.5 47.12,34.54 45.85,35.81 v19.81,35.94 | v18.67,30.73 v12.57,30.73
XTAL1  (via drill 0.6)
  Top 0.203: 61.21,44.95 61.21,43.18 61.34,43.05 R1.1
  Top 0.254: U1.17 44.45,42.29 v43.56,42.42 | C2.1 61.21,44.95 58.56,44.95 Y1.2
  Bottom 0.254: v43.56,42.42 44.32,42.55 44.45,42.93 55.24,42.93 57.15,45.21 57.15,46.1 Y1.2
XTAL2  (via drill 0.6)
  Top 0.203: 61.21,41.15 61.21,39.5 61.34,39.37 C1.2 | 61.21,41.15 61.34,41.27 62.74,41.27 R1.2 | Y1.1 61.21,41.15
  Top 0.254: U1.16 45.21,37.17 v45.34,41.91
  Bottom 0.254: v45.34,41.91 45.47,42.42 55.75,42.42 Y1.1

### Text on the board
tPlace: RESET | Gnd | 5v AC / Sense | 5V in | 1 | ICSP | 22 | +12 | + | 1K | 47K | 10K | 100n | 1uF | 10K | 47K | Disconnect when / using 5V in | 10K | Thermistor | 1vZener | Display | lt1495 | 1K | Current_Monitor_v1.1 | Menu | Schoolserver.wordpress.com/power
tValues: Display | Display | To Battery